# Altium project Board Connector Template.PrjPcb
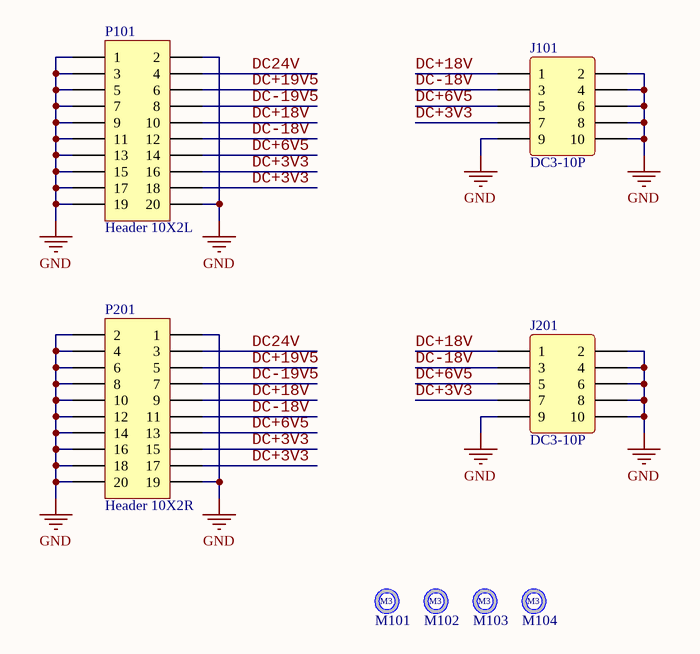
[diagram p0: Board Connector Template.SchDoc]
1 sheet, 8 parts. Net scope: global (net labels, ports and power ports of the same name join across sheets).
Board file: Board Connector Template.PcbDoc

## Sheet Board Connector Template.SchDoc
size A4; SheetNumber: 1; SheetTotal: 1

### Parts
J101  DC3-10P  [DC3-10P]
J201  DC3-10P  [DC3-10P]
M101  M3  [M3-3.2X5]  (value not drawn)
M102  M3  [M3-3.2X5]  (value not drawn)
M103  M3  [M3-3.2X5]  (value not drawn)
M104  M3  [M3-3.2X5]  (value not drawn)
P101  Header 10X2L  [HDR2X10LML]
P201  Header 10X2R  [HDR2X10LFR]

### Nets
GND: J101.2 J101.4 J101.6 J101.8 J101.9 J101.10 J201.2 J201.4 J201.6 J201.8 J201.9 J201.10 P101.1 P101.2 P101.3 P101.5 P101.7 P101.9 P101.11 P101.13 P101.15 P101.17 P101.19 P101.20 P201.1 P201.2 P201.4 P201.6 P201.8 P201.10 P201.12 P201.14 P201.16 P201.18 P201.19 P201.20
DC24V: P101.4 P201.3
DC+3V3: J101.7 J201.7 P101.16 P101.18 P201.15 P201.17
DC+6V5: J101.5 J201.5 P101.14 P201.13
DC+18V: J101.1 J201.1 P101.10 P201.9
DC+19V5: P101.6 P201.5
DC-18V: J101.3 J201.3 P101.12 P201.11
DC-19V5: P101.8 P201.7

### Library data of the parts
P101 = Header 10X2L: Header, 10-Pin, Dual row, Pin 1 on Left
P201 = Header 10X2R: Header, 10-Pin, Dual row, Pin 1 on Right